# EAGLE design Robo_Creative_Lab_9 (EAGLE 6.6.0)
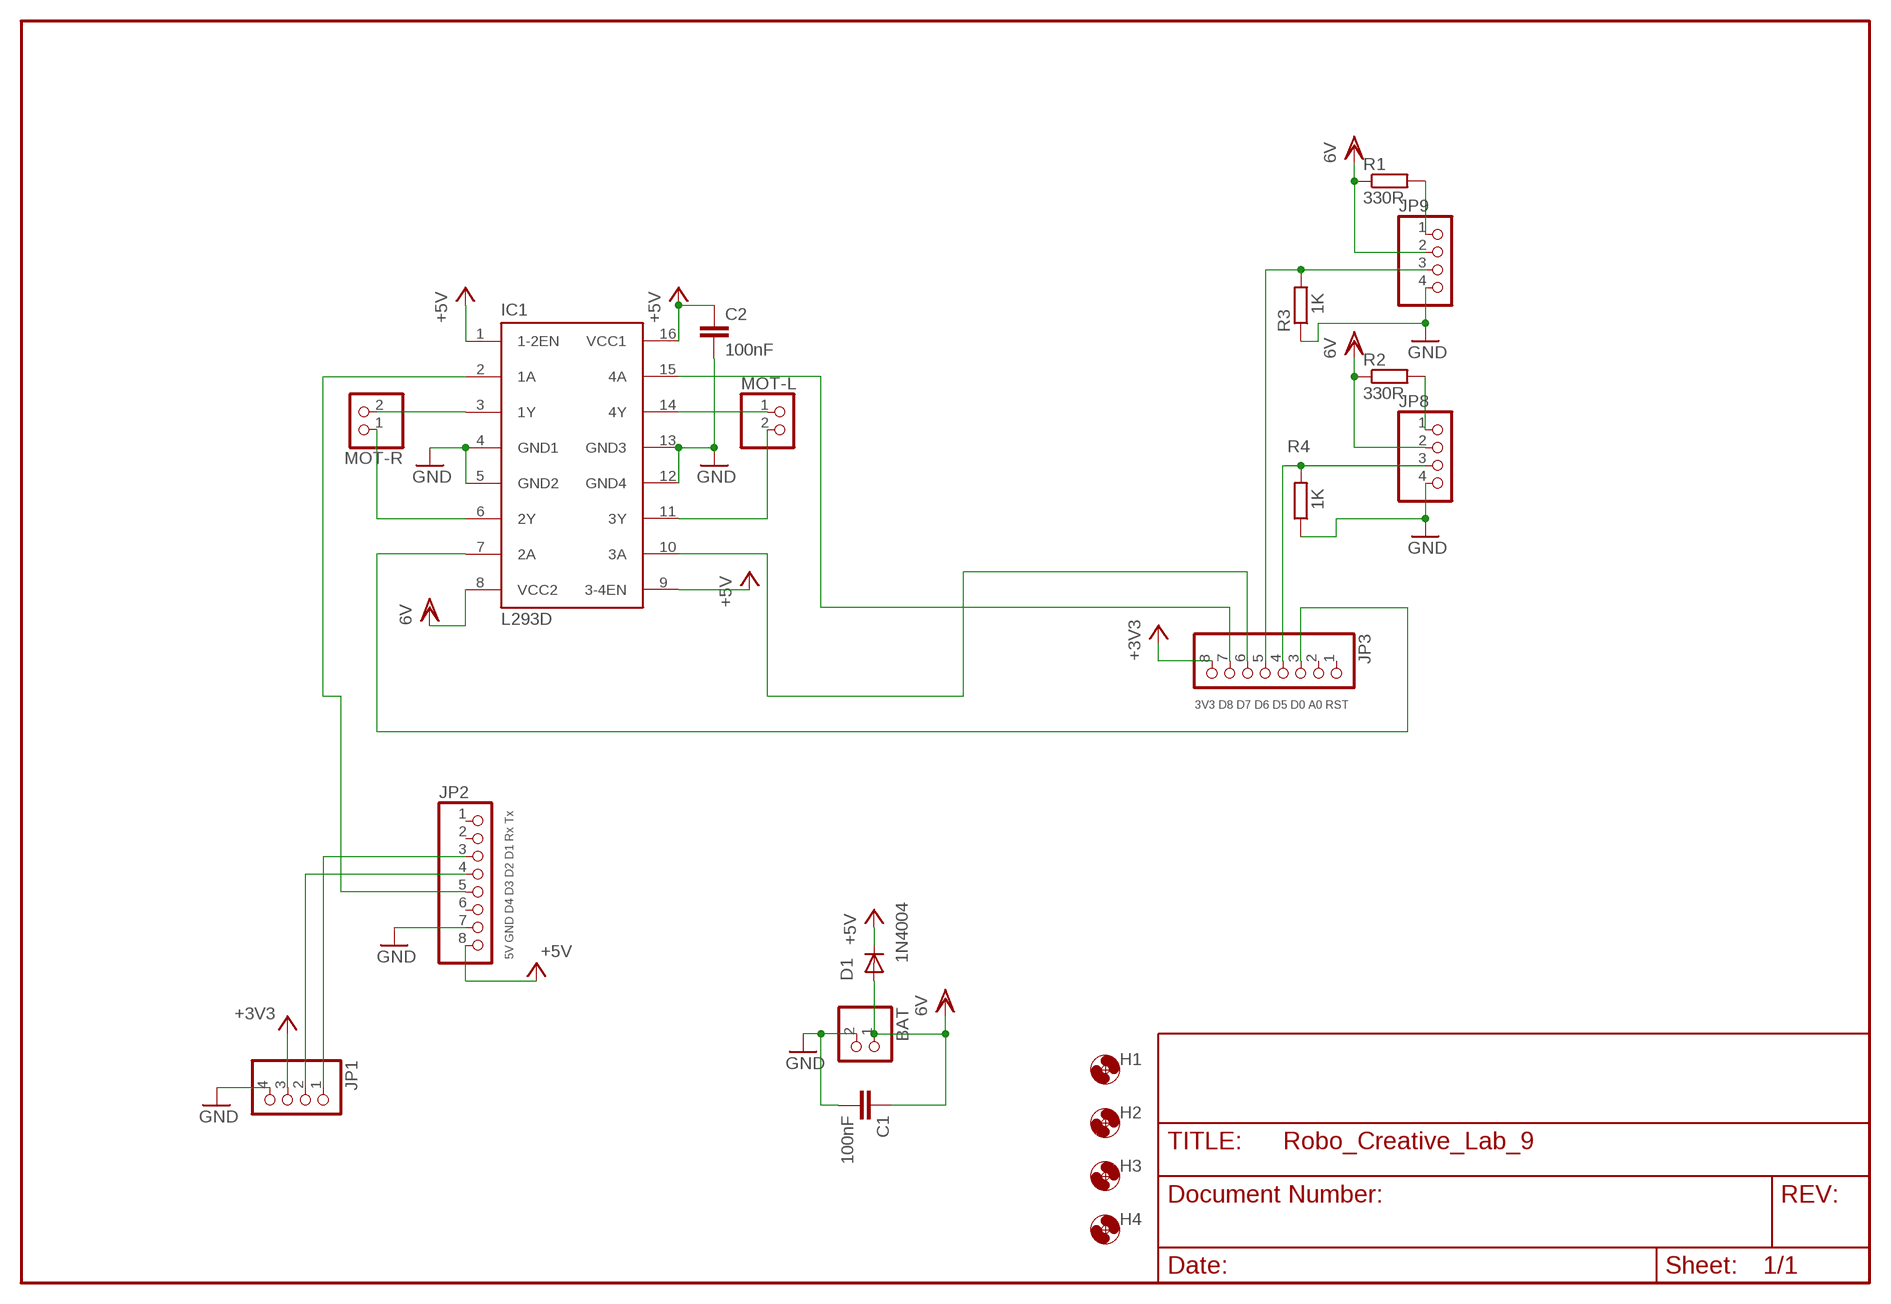
[diagram p0: schematic, sheet 1]

## Parts
BAT  PINHD-1X2  [1X02]
C1  100nF  C-EU050-025X075  [C050-025X075]
C2  100nF  C-EU050-025X075  [C050-025X075]
D1  1N4004  [DO41-10]
H1  MOUNT-HOLE3.2  [3,2]
H2  MOUNT-HOLE3.2  [3,2]
H3  MOUNT-HOLE3.2  [3,2]
H4  MOUNT-HOLE3.2  [3,2]
IC1  L293D  [DIL16]
JP1  PINHD-1X4  [1X04]
JP2  PINHD-1X8  [1X08]
JP3  PINHD-1X8  [1X08]
JP8  PINHD-1X4  [1X04]
JP9  PINHD-1X4  [1X04]
MOT-L  PINHD-1X2  [1X02]
MOT-R  PINHD-1X2  [1X02]
R1  330R  R-EU_0207/10  [0207/10]
R2  330R  R-EU_0207/10  [0207/10]
R3  1K  R-EU_0207/10  [0207/10]
R4  1K  R-EU_0207/10  [0207/10]

## Nets
+3V3: JP1.3 JP3.8
+5V [usbvcc]: C2.1 D1.C IC1.1(1-2EN) IC1.9(3-4EN) IC1.16(VCC1) JP2.8
GND [gnd]: BAT.2 C1.2 C2.2 IC1.4(GND1) IC1.5(GND2) IC1.12(GND4) IC1.13(GND3) JP1.4 JP2.7 JP8.4 JP9.4 R3.1 R4.1
N$1: IC1.3(1Y) MOT-R.2
N$2: IC1.6(2Y) MOT-R.1
N$3: IC1.14(4Y) MOT-L.1
N$4: IC1.11(3Y) MOT-L.2
N$5: IC1.7(2A) JP3.3
N$6: IC1.10(3A) JP3.6
N$8: IC1.15(4A) JP3.7
N$9: JP8.1 R2.2
N$10: JP9.1 R1.2
N$11: IC1.2(1A) JP2.5
N$12: JP3.5 JP9.3 R3.2
N$13: JP3.4 JP8.3 R4.2
N$15: JP1.1 JP2.3
N$16: JP1.2 JP2.4
VDD: BAT.1 C1.1 D1.A IC1.8(VCC2) JP8.2 JP9.2 R1.1 R2.1 ; supply symbol labelled 6V
Unconnected: JP2.1 JP2.2 JP2.6 JP3.1 JP3.2

## Notes on the sheet
- 3V3 D8 D7 D6 D5 D0 A0 RST
- 5V GND D4 D3 D2 D1 Rx Tx

## Library data of the parts
BAT MOT-L MOT-R = pinhead:PINHD-1X2: PIN HEADER
C1 C2 = rcl:C-EU: CAPACITOR, European symbol
D1 = diode:1N4004: DIODE general purpose rectifier, 1 A
H1-H4 = holes:MOUNT-HOLE: MOUNTING HOLE with drill center marker
IC1 = st-microelectronics:L293D: PUSH-PULL 4 CHANNEL DRIVER; MPN: L293D; OC_FARNELL: 9589619; OC_NEWARK: 56P8249
JP1 JP8 JP9 = pinhead:PINHD-1X4: PIN HEADER
JP2 JP3 = pinhead:PINHD-1X8: PIN HEADER
R1-R4 = rcl:R-EU_: RESISTOR, European symbol

## Net classes
0 default: width 0.254 mm, drill 0.61 mm, clearance 0.254 mm
1 power: width 0.254 mm, drill 0.61 mm, clearance 0.254 mm
2 gnd: width 0.254 mm, drill 0.61 mm, clearance 0.254 mm
3 usbvcc: width 0.254 mm, drill 0.61 mm, clearance 0.254 mm
4 aref: width 0.254 mm, drill 0.61 mm, clearance 0.254 mm

## Board
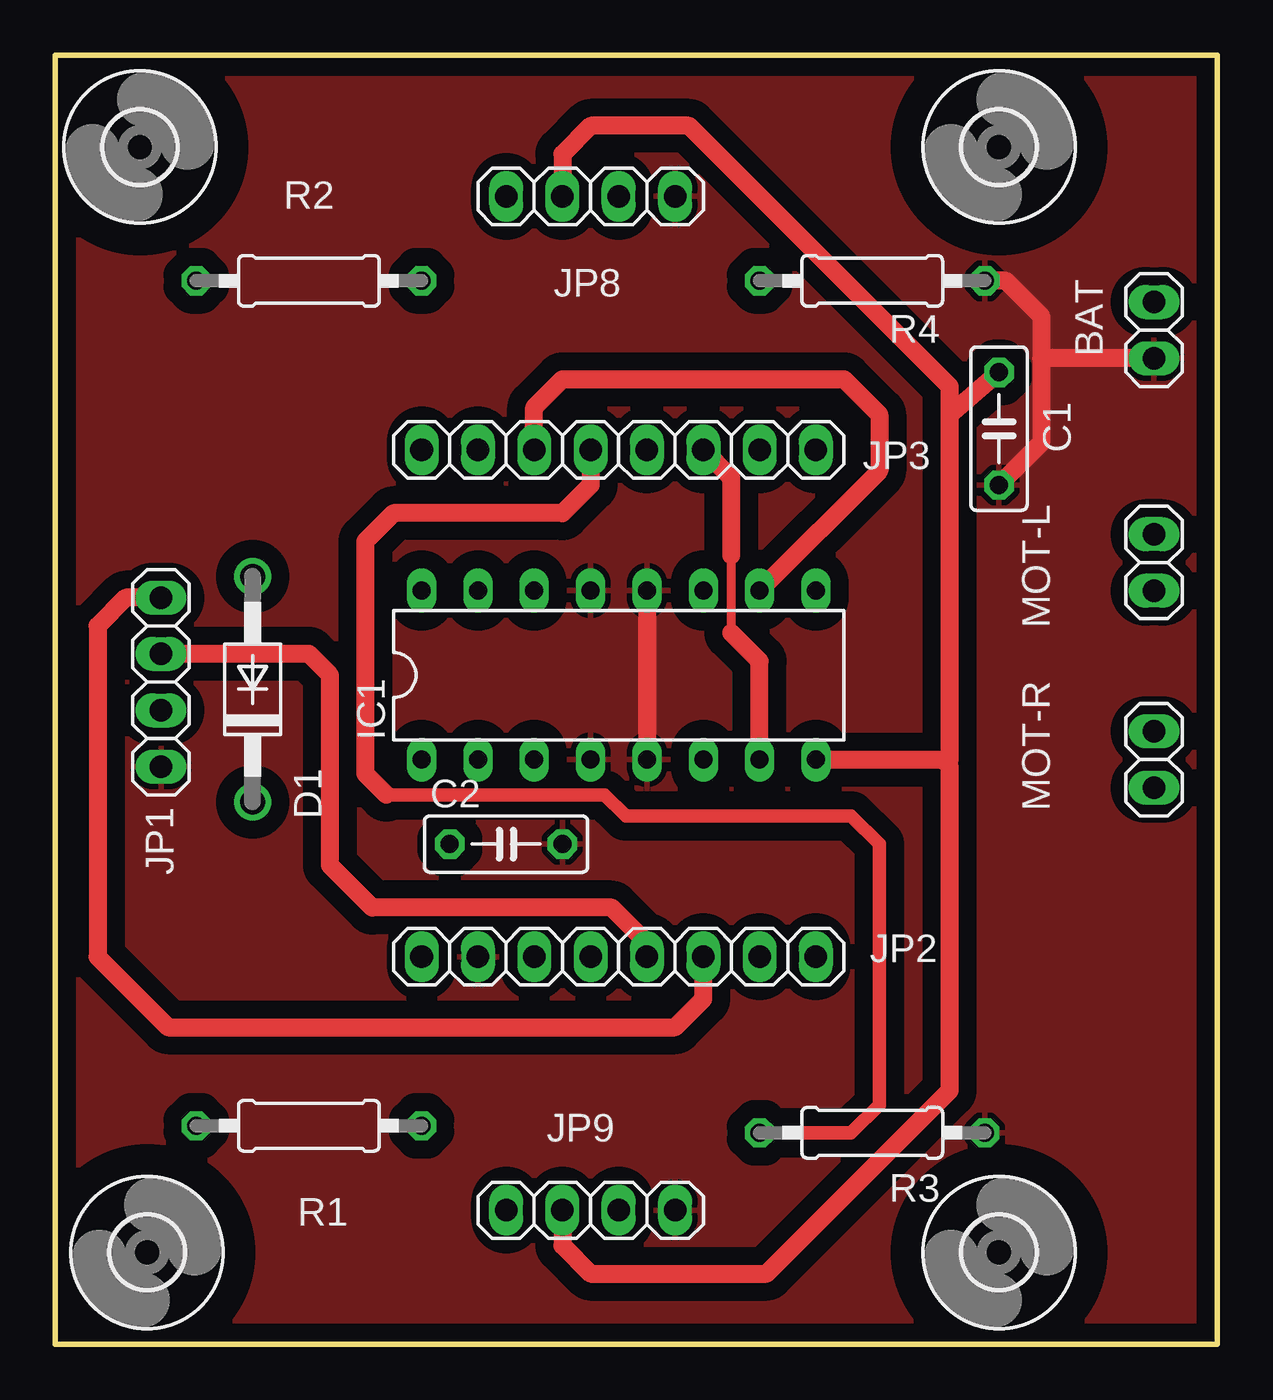
[diagram p1: board, top side]
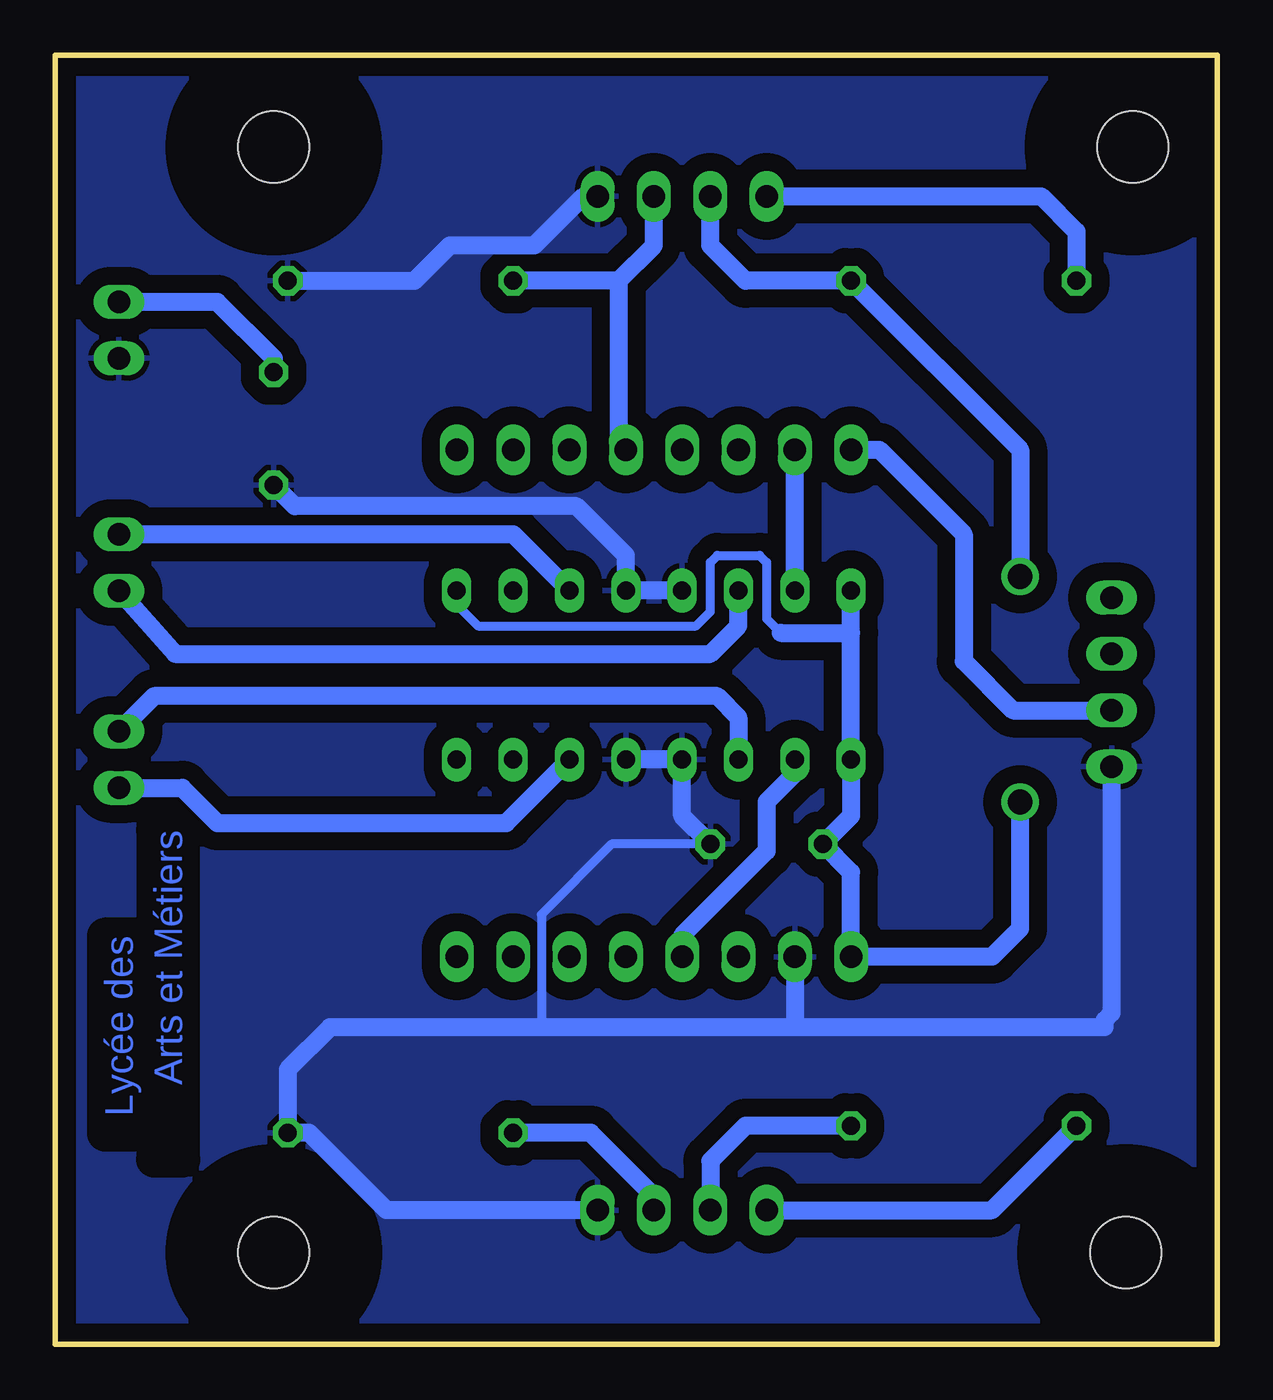
[diagram p2: board, bottom side, seen from below]

Size 52.39 x 58.1 mm. Coordinates in mm from the lower left corner, seen from the top.
Outline: 0,0 0,58.1 52.39,58.1 52.39,0 0,0
Copper layers (1*16): Top 0.035mm / dielectric 1.5mm / Bottom 0.035mm
Design rules "default": minimum track width 10mil, minimum drill 22mil, track to track 10mil, track to pad 10mil, pad to pad 8mil, via to via 12mil, smd to smd 8mil, copper to edge 24mil, drill to drill 12mil, minimum pad ring 10mil, minimum via ring 10mil, stop-mask expansion 2mil, vias tented up to drill 30mil, thermal gap 10mil
vRestrict: area 47.9,10.3 to 48.5,10.8; area 50.4,10.2 to 50.9,11

### Footprints (pad centres in the part's own frame; a part is rotated, then mirrored left to right if it is on the bottom)
1X02 = drill 1.016 long: 1 -1.27,0; 2 1.27,0
C050-025X075 = drill 0.813 octagon: 1 -2.54,0; 2 2.54,0
DO41-10 = drill 1.118: A 5.08,0; C -5.08,0
3,2 = hole 3.2: 0,0
DIL16 = drill 0.813 long: 1 -8.89,-3.81; 2 -6.35,-3.81; 3 -3.81,-3.81; 4 -1.27,-3.81; 5 1.27,-3.81; 6 3.81,-3.81; 7 6.35,-3.81; 8 8.89,-3.81; 9 8.89,3.81; 10 6.35,3.81; 11 3.81,3.81; 12 1.27,3.81; 13 -1.27,3.81; 14 -3.81,3.81; 15 -6.35,3.81; 16 -8.89,3.81
1X04 = drill 1.016 long: 1 -3.81,0; 2 -1.27,0; 3 1.27,0; 4 3.81,0
1X08 = drill 1.016 long: 1 -8.89,0; 2 -6.35,0; 3 -3.81,0; 4 -1.27,0; 5 1.27,0; 6 3.81,0; 7 6.35,0; 8 8.89,0
0207/10 = drill 0.813 octagon: 1 -5.08,0; 2 5.08,0

### Placement (x,y rotation side)
BAT  49.53,45.72 270 top
C1  42.55,41.27 270 top
C2  20.32,22.54 0 top
D1  8.89,29.53 90 top
H1  4.13,4.13 0 top
H2  3.81,53.98 0 top
H3  42.55,4.13 0 top
H4  42.55,53.98 0 top
IC1  25.4,30.16 0 top
JP1  4.76,29.84 270 top
JP2  25.4,17.46 180 top
JP3  25.4,40.32 180 top
JP8  24.13,51.75 0 top
JP9  24.13,6.03 0 top
MOT-L  49.53,35.24 90 top
MOT-R  49.53,26.35 90 top
R1  11.43,9.84 180 top
R2  11.43,47.94 180 top
R3  36.83,9.53 180 top
R4  36.83,47.94 180 top

### Tracks (layer width: path | path; a pad name or v marks a point on that pad's centre or on a via)
+3V3
  Bottom 0.813: JP3.8 15.24,40.32 11.43,36.51 11.43,30.8 9.21,28.57 JP1.3
+5V
  Bottom 0.406: IC1.9 34.29,33.34 33.34,32.38 23.5,32.38 22.86,33.02 22.86,35.24 22.54,35.56 20.64,35.56 20.32,35.24 20.32,32.7 19.68,32.07
  Bottom 0.813: 16.51,32.07 IC1.1 16.51,23.81 C2.1 16.51,21.27 JP2.8 10.16,17.46 8.89,18.73 D1.C | 16.51,32.07 IC1.16 | 19.68,32.07 16.51,32.07
GND
  Top 0.813: IC1.12 IC1.5 | 44.45,44.45 44.45,46.35 42.86,47.94 R4.1 | 44.45,44.45 44.45,40.64 C1.2 | BAT.2 44.45,44.45
  Bottom 0.406: C2.2 27.3,22.54 30.48,19.37 30.48,14.29
  Bottom 0.813: C2.2 24.13,23.81 IC1.4 IC1.5 | 19.05,14.29 5.08,14.29 5.08,14.61 4.76,14.92 JP1.4 | JP2.7 19.05,14.29 | 19.05,14.29 30.48,14.29 40.01,14.29 41.91,12.38 R3.1 40.96,9.53 37.47,6.03 JP9.4 | IC1.13 IC1.12 26.67,35.56 28.89,37.78 41.59,37.78 C1.2 | JP8.4 28.57,51.75 30.8,49.53 34.61,49.53 36.2,47.94 R4.1
  pour Top (isolate 0.813): 0,58.1 52.39,58.1 52.39,0 0,0
  pour Bottom (isolate 0.813): 0,58.1 52.39,58.1 52.39,0 0,0
N$1
  Bottom 0.813: IC1.3 21.59,28.26 22.54,29.21 47.94,29.21 MOT-R.2
N$2
  Bottom 0.813: MOT-R.1 46.67,25.08 45.09,23.5 32.07,23.5 IC1.6
N$3
  Bottom 0.813: IC1.14 21.59,32.38 22.86,31.11 46.99,31.11 MOT-L.1
N$4
  Bottom 0.813: MOT-L.2 31.75,36.51 IC1.11
N$5
  Top 0.406: 30.48,32.07 30.48,35.56
  Top 0.813: IC1.7 31.75,30.8 30.48,32.07 | 30.48,35.56 30.48,39.05 JP3.3
N$6
  Top 0.813: JP3.6 21.59,42.23 22.86,43.5 35.56,43.5 37.15,41.91 37.15,39.37 IC1.10
N$8
  Bottom 0.813: IC1.15 JP3.7
N$9
  Bottom 0.813: JP8.1 7.94,51.75 6.35,50.16 R2.2
N$10
  Bottom 0.813: JP9.1 10.16,6.03 R1.2
N$11
  Bottom 0.813: IC1.2 19.05,25.72 20.32,24.45 20.32,22.23 24.13,18.41 JP2.5
N$12
  Top 0.61: 14.92,24.77 24.77,24.77 25.72,23.81 35.88,23.81 37.15,22.54 37.15,10.79 35.88,9.53 R3.2
  Top 0.813: JP3.5 24.13,38.73 22.86,37.47 15.24,37.47 13.97,36.2 13.97,25.72 14.92,24.77
  Bottom 0.813: JP9.3 25.4,6.67 28.26,9.53 R3.2
N$13
  Bottom 0.813: 26.99,47.94 25.4,49.53 JP8.3 | 26.99,47.94 26.99,40.64 JP3.4 | 26.99,47.94 R4.2
N$15
  Top 0.813: JP1.1 3.17,33.66 1.91,32.38 1.91,17.46 5.08,14.29 27.94,14.29 29.21,15.56 JP2.3
N$16
  Top 0.813: JP2.4 26.67,18.1 25.08,19.68 14.29,19.68 12.38,21.59 12.38,30.16 11.43,31.11 JP1.2
VDD
  Top 0.813: IC1.8 40.01,26.35 | 40.01,26.35 40.32,26.35 40.32,41.91 | JP9.2 22.86,4.45 24.13,3.17 32.07,3.17 40.32,11.43 40.32,26.04 40.01,26.35 | 40.32,41.91 C1.1 | 40.32,41.91 40.32,43.18 28.57,54.93 24.13,54.93 22.86,53.66 JP8.2
  Bottom 0.813: JP8.2 22.86,49.53 21.27,47.94 R2.1 8.89,40.32 D1.A | R1.1 21.27,9.84 22.86,8.26 JP9.2 | C1.1 42.55,44.45 45.09,46.99 BAT.1

### Text on the board
Bottom: Arts et Métiers | Lycée des
Document: + | 3V3 | D8 | D7 | D6 | D5 | D0 | A0 | RST | - | + | - | + | - | 5V | GND | D4 | D3 | D2 | D1 | Rx | Tx | Lycée des | Arts et Métiers | Creative-Lab.lu | Space-Mining-Rover | Snider 1